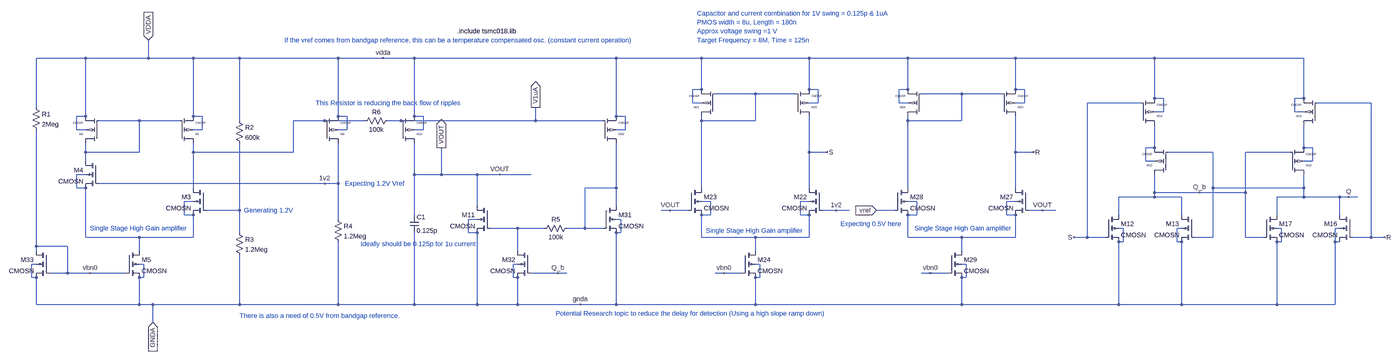
[diagram p0: schematic Oscillator.asc, whole sheet]
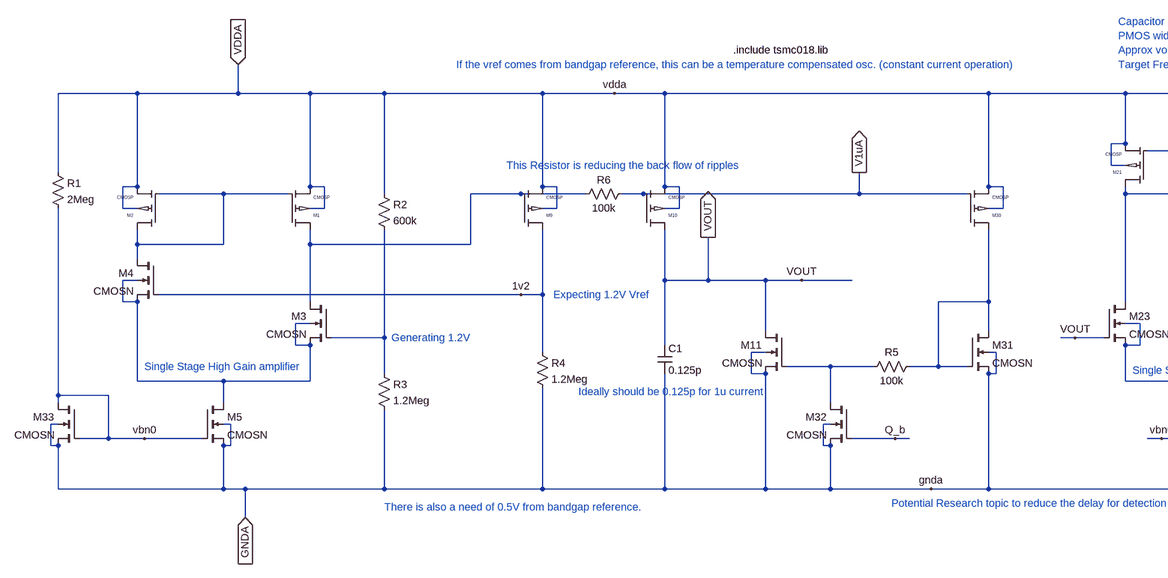
[diagram p1: schematic Oscillator.asc, part, row 1 of 1, column 1 of 2]
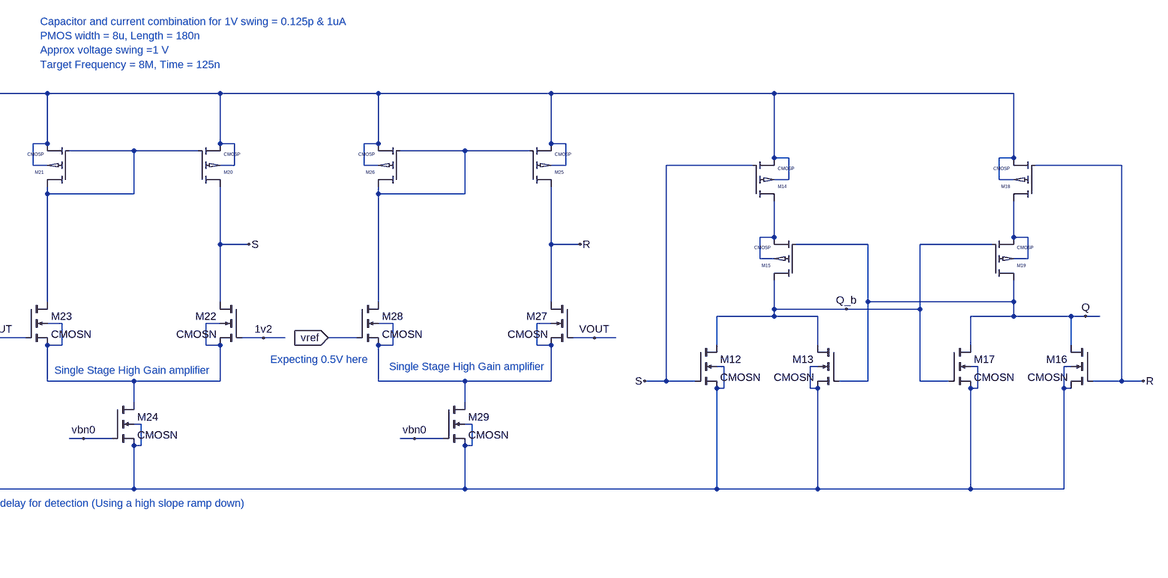
[diagram p2: schematic Oscillator.asc, part, row 1 of 1, column 2 of 2]
Oscillator.asc, the LTspice schematic file:
Version 4
SHEET 1 6116 744
WIRE 352 -336 176 -336
WIRE 576 -336 576 -400
WIRE 576 -336 352 -336
WIRE 736 -336 576 -336
WIRE 976 -336 736 -336
WIRE 1328 -336 976 -336
WIRE 1488 -336 1328 -336
WIRE 1600 -336 1488 -336
WIRE 2320 -336 1600 -336
WIRE 2624 -336 2320 -336
WIRE 3008 -336 2624 -336
WIRE 3360 -336 3008 -336
WIRE 3744 -336 3360 -336
WIRE 4240 -336 3744 -336
WIRE 4832 -336 4240 -336
WIRE 2624 -224 2624 -336
WIRE 2624 -224 2592 -224
WIRE 3008 -224 3008 -336
WIRE 3040 -224 3008 -224
WIRE 3360 -224 3360 -336
WIRE 3360 -224 3328 -224
WIRE 3744 -224 3744 -336
WIRE 3776 -224 3744 -224
WIRE 2816 -208 2672 -208
WIRE 2960 -208 2816 -208
WIRE 3552 -208 3408 -208
WIRE 3696 -208 3552 -208
WIRE 4240 -192 4240 -336
WIRE 4272 -192 4240 -192
WIRE 4832 -192 4832 -336
WIRE 4832 -192 4800 -192
WIRE 2592 -176 2592 -224
WIRE 2624 -176 2592 -176
WIRE 3040 -176 3040 -224
WIRE 3040 -176 3008 -176
WIRE 3328 -176 3328 -224
WIRE 3360 -176 3328 -176
WIRE 3776 -176 3776 -224
WIRE 3776 -176 3744 -176
WIRE 4192 -176 4000 -176
WIRE 5072 -176 4880 -176
WIRE 176 -160 176 -336
WIRE 4272 -144 4272 -192
WIRE 4272 -144 4240 -144
WIRE 4800 -144 4800 -192
WIRE 4832 -144 4800 -144
WIRE 352 -128 352 -336
WIRE 352 -128 320 -128
WIRE 736 -128 736 -336
WIRE 768 -128 736 -128
WIRE 1328 -128 1328 -336
WIRE 1360 -128 1328 -128
WIRE 1600 -128 1600 -336
WIRE 1632 -128 1600 -128
WIRE 2320 -128 2320 -336
WIRE 2352 -128 2320 -128
WIRE 544 -112 400 -112
WIRE 688 -112 544 -112
WIRE 976 -112 976 -336
WIRE 1280 -112 1168 -112
WIRE 1424 -112 1280 -112
WIRE 1552 -112 1504 -112
WIRE 2032 -112 2032 -160
WIRE 2032 -112 1552 -112
WIRE 2272 -112 2032 -112
WIRE 2624 -112 2624 -128
WIRE 2816 -112 2816 -208
WIRE 2816 -112 2624 -112
WIRE 3360 -112 3360 -128
WIRE 3552 -112 3552 -208
WIRE 3552 -112 3360 -112
WIRE 320 -80 320 -128
WIRE 352 -80 320 -80
WIRE 768 -80 768 -128
WIRE 768 -80 736 -80
WIRE 1360 -80 1360 -128
WIRE 1360 -80 1328 -80
WIRE 1632 -80 1632 -128
WIRE 1632 -80 1600 -80
WIRE 2352 -80 2352 -128
WIRE 2352 -80 2320 -80
WIRE 4240 -16 4240 -96
WIRE 4240 -16 4208 -16
WIRE 4832 -16 4832 -96
WIRE 4864 -16 4832 -16
WIRE 352 0 352 -32
WIRE 544 0 544 -112
WIRE 544 0 352 0
WIRE 736 0 736 -32
WIRE 1168 0 1168 -112
WIRE 1168 0 736 0
WIRE 3008 0 3008 -128
WIRE 3072 0 3008 0
WIRE 3744 0 3744 -128
WIRE 3808 0 3744 0
WIRE 4448 0 4288 0
WIRE 4784 0 4624 0
WIRE 352 32 352 0
WIRE 4208 32 4208 -16
WIRE 4240 32 4208 32
WIRE 4864 32 4864 -16
WIRE 4864 32 4832 32
WIRE 352 80 320 80
WIRE 1600 80 1600 -32
WIRE 1696 80 1696 -16
WIRE 1696 80 1600 80
WIRE 1824 80 1696 80
WIRE 1904 80 1824 80
WIRE 2016 80 1904 80
WIRE 1280 112 400 112
WIRE 1328 112 1328 -32
WIRE 1328 112 1280 112
WIRE 320 128 320 80
WIRE 352 128 320 128
WIRE 736 128 736 0
WIRE 2320 128 2320 -32
WIRE 2320 128 2208 128
WIRE 2624 128 2624 -112
WIRE 3008 128 3008 0
WIRE 3360 128 3360 -112
WIRE 3744 128 3744 0
WIRE 4448 128 4448 0
WIRE 4832 128 4832 80
WIRE 4832 128 4448 128
WIRE 4240 144 4240 80
WIRE 4400 144 4240 144
WIRE 4624 144 4624 0
WIRE 4624 144 4400 144
WIRE 4240 160 4240 144
WIRE 4240 160 4112 160
WIRE 4336 160 4240 160
WIRE 4832 160 4832 128
WIRE 4832 160 4736 160
WIRE 4960 160 4832 160
WIRE 4992 160 4960 160
WIRE 5024 160 4992 160
WIRE 736 176 704 176
WIRE 2656 176 2624 176
WIRE 3008 176 2976 176
WIRE 3392 176 3360 176
WIRE 3744 176 3712 176
WIRE 1824 192 1824 80
WIRE 2320 192 2320 128
WIRE 976 208 976 -32
WIRE 976 208 784 208
WIRE 2512 208 2480 208
WIRE 2576 208 2512 208
WIRE 3104 208 3056 208
WIRE 3152 208 3104 208
WIRE 3312 208 3248 208
WIRE 3840 208 3792 208
WIRE 3888 208 3840 208
WIRE 704 224 704 176
WIRE 736 224 704 224
WIRE 1600 224 1600 80
WIRE 2656 224 2656 176
WIRE 2656 224 2624 224
WIRE 2976 224 2976 176
WIRE 3008 224 2976 224
WIRE 3392 224 3392 176
WIRE 3392 224 3360 224
WIRE 3712 224 3712 176
WIRE 3744 224 3712 224
WIRE 4112 224 4112 160
WIRE 4336 224 4336 160
WIRE 4736 224 4736 160
WIRE 4960 224 4960 160
WIRE 1328 240 1328 112
WIRE 1824 240 1792 240
WIRE 2336 240 2320 240
WIRE 1968 272 1872 272
WIRE 2064 272 1968 272
WIRE 2208 272 2208 128
WIRE 2208 272 2144 272
WIRE 2272 272 2208 272
WIRE 4128 272 4112 272
WIRE 4336 272 4320 272
WIRE 4752 272 4736 272
WIRE 4960 272 4944 272
WIRE 976 288 976 208
WIRE 1792 288 1792 240
WIRE 1824 288 1792 288
WIRE 2336 288 2336 240
WIRE 2336 288 2320 288
WIRE 352 304 352 128
WIRE 544 304 352 304
WIRE 736 304 736 224
WIRE 736 304 544 304
WIRE 2624 304 2624 224
WIRE 2816 304 2624 304
WIRE 3008 304 3008 224
WIRE 3008 304 2816 304
WIRE 3360 304 3360 224
WIRE 3552 304 3360 304
WIRE 3744 304 3744 224
WIRE 3744 304 3552 304
WIRE 4000 304 4000 -176
WIRE 4000 304 3952 304
WIRE 4064 304 4000 304
WIRE 4448 304 4448 128
WIRE 4448 304 4384 304
WIRE 4624 304 4624 144
WIRE 4688 304 4624 304
WIRE 5072 304 5072 -176
WIRE 5072 304 5008 304
WIRE 5120 304 5072 304
WIRE 4128 320 4128 272
WIRE 4128 320 4112 320
WIRE 4320 320 4320 272
WIRE 4336 320 4320 320
WIRE 4752 320 4752 272
WIRE 4752 320 4736 320
WIRE 4944 320 4944 272
WIRE 4960 320 4944 320
WIRE 176 336 176 -80
WIRE 288 336 176 336
WIRE 176 352 176 336
WIRE 544 352 544 304
WIRE 1968 352 1968 272
WIRE 2816 352 2816 304
WIRE 3552 352 3552 304
WIRE 176 400 160 400
WIRE 560 400 544 400
WIRE 1968 400 1952 400
WIRE 2832 400 2816 400
WIRE 3568 400 3552 400
WIRE 288 432 288 336
WIRE 288 432 224 432
WIRE 368 432 288 432
WIRE 496 432 368 432
WIRE 2112 432 2016 432
WIRE 2144 432 2112 432
WIRE 2704 432 2672 432
WIRE 2768 432 2704 432
WIRE 3440 432 3408 432
WIRE 3504 432 3440 432
WIRE 160 448 160 400
WIRE 176 448 160 448
WIRE 560 448 560 400
WIRE 560 448 544 448
WIRE 1952 448 1952 400
WIRE 1968 448 1952 448
WIRE 2832 448 2832 400
WIRE 2832 448 2816 448
WIRE 3568 448 3568 400
WIRE 3568 448 3552 448
WIRE 176 544 176 448
WIRE 544 544 544 448
WIRE 544 544 176 544
WIRE 592 544 544 544
WIRE 976 544 976 368
WIRE 976 544 592 544
WIRE 1328 544 1328 320
WIRE 1328 544 976 544
WIRE 1600 544 1600 288
WIRE 1600 544 1328 544
WIRE 1824 544 1824 288
WIRE 1824 544 1600 544
WIRE 1968 544 1968 448
WIRE 1968 544 1824 544
WIRE 2192 544 1968 544
WIRE 2320 544 2320 288
WIRE 2320 544 2192 544
WIRE 2816 544 2816 448
WIRE 2816 544 2320 544
WIRE 3552 544 3552 448
WIRE 3552 544 2816 544
WIRE 4112 544 4112 320
WIRE 4112 544 3552 544
WIRE 4336 544 4336 320
WIRE 4336 544 4112 544
WIRE 4736 544 4736 320
WIRE 4736 544 4336 544
WIRE 4944 544 4944 320
WIRE 4944 544 4736 544
WIRE 592 608 592 544
FLAG 3248 208 vref
IOPIN 3248 208 In
FLAG 576 -400 VDDA
IOPIN 576 -400 In
FLAG 592 608 GNDA
IOPIN 592 608 In
FLAG 368 432 vbn0
FLAG 1696 -16 VOUT
IOPIN 1696 -16 Out
FLAG 1488 -336 vdda
FLAG 4992 160 Q
FLAG 3952 304 S
FLAG 5120 304 R
FLAG 4400 144 Q_b
FLAG 1904 80 VOUT
FLAG 2192 544 gnda
FLAG 3104 208 1v2
FLAG 2512 208 VOUT
FLAG 3072 0 S
FLAG 2704 432 vbn0
FLAG 3840 208 VOUT
FLAG 3808 0 R
FLAG 3440 432 vbn0
FLAG 2112 432 Q_b
FLAG 1280 112 1v2
FLAG 2032 -160 V1uA
IOPIN 2032 -160 Out
SYMBOL cmosp 688 -32 M180
SYMATTR InstName M1
SYMATTR Value2 l=360n w=2.5u
SYMBOL cmosp 400 -32 R180
SYMATTR InstName M2
SYMATTR Value2 l=360n w=2.5u
SYMBOL cmosn 784 128 M0
SYMATTR InstName M3
SYMATTR Value2 l=360n w=500n
SYMBOL cmosn 400 32 M0
SYMATTR InstName M4
SYMATTR Value2 l=360n w=500n
SYMBOL cmosn 496 352 R0
SYMATTR InstName M5
SYMATTR Value2 l=720n w=2u
SYMBOL cmosp 1280 -32 M180
SYMATTR InstName M9
SYMATTR Value2 l=180n w=1u
SYMBOL cmosp 1552 -32 M180
SYMATTR InstName M10
SYMATTR Value2 l=180n w=1.1u
SYMBOL cap 1584 224 R0
SYMATTR InstName C1
SYMATTR Value 0.125p
SYMBOL cmosn 1872 192 M0
SYMATTR InstName M11
SYMATTR Value2 l=180n w=2.2u
SYMBOL cmosn 4064 224 R0
SYMATTR InstName M12
SYMATTR Value2 l=180n w=270n
SYMBOL cmosn 4384 224 M0
SYMATTR InstName M13
SYMATTR Value2 l=180n w=270n
SYMBOL cmosp 4192 -96 M180
SYMATTR InstName M14
SYMATTR Value2 l=180n w=1u
SYMBOL cmosp 4288 80 R180
SYMATTR InstName M15
SYMATTR Value2 l=180n w=1u
SYMBOL cmosn 5008 224 M0
SYMATTR InstName M16
SYMATTR Value2 l=180n w=270n
SYMBOL cmosn 4688 224 R0
SYMATTR InstName M17
SYMATTR Value2 l=180n w=270n
SYMBOL cmosp 4880 -96 R180
SYMATTR InstName M18
SYMATTR Value2 l=180n w=270n
SYMBOL cmosp 4784 80 M180
SYMATTR InstName M19
SYMATTR Value2 l=180n w=270n
SYMBOL cmosp 2960 -128 M180
SYMATTR InstName M20
SYMATTR Value2 l=180n w=5u
SYMBOL cmosp 2672 -128 R180
SYMATTR InstName M21
SYMATTR Value2 l=180n w=5u
SYMBOL cmosn 3056 128 M0
SYMATTR InstName M22
SYMATTR Value2 l=180n w=1u
SYMBOL cmosn 2576 128 R0
SYMATTR InstName M23
SYMATTR Value2 l=180n w=1u
SYMBOL cmosn 2768 352 R0
SYMATTR InstName M24
SYMATTR Value2 l=720n w=2u
SYMBOL cmosp 3696 -128 M180
SYMATTR InstName M25
SYMATTR Value2 l=180n w=1u
SYMBOL cmosp 3408 -128 R180
SYMATTR InstName M26
SYMATTR Value2 l=180n w=1u
SYMBOL cmosn 3792 128 M0
SYMATTR InstName M27
SYMATTR Value2 l=180n w=270n
SYMBOL cmosn 3312 128 R0
SYMATTR InstName M28
SYMATTR Value2 l=180n w=270n
SYMBOL cmosn 3504 352 R0
SYMATTR InstName M29
SYMATTR Value2 l=720n w=2u
SYMBOL cmosp 2272 -32 M180
SYMATTR InstName M30
SYMATTR Value2 l=180n w=11u
SYMBOL res 2160 256 R90
WINDOW 0 0 56 VBottom 2
WINDOW 3 32 56 VTop 2
SYMATTR InstName R5
SYMATTR Value 100k
SYMBOL cmosn 2272 192 R0
SYMATTR InstName M31
SYMATTR Value2 l=180n w=1u
SYMBOL cmosn 2016 352 M0
SYMATTR InstName M32
SYMATTR Value2 l=180n w=270n
SYMBOL res 1520 -128 R90
WINDOW 0 0 56 VBottom 2
WINDOW 3 32 56 VTop 2
SYMATTR InstName R6
SYMATTR Value 100k
SYMBOL cmosn 224 352 M0
SYMATTR InstName M33
SYMATTR Value2 l=720n w=2u
SYMBOL res 1312 224 R0
SYMATTR InstName R4
SYMATTR Value 1.2Meg
SYMBOL res 160 -176 R0
SYMATTR InstName R1
SYMATTR Value 2Meg
SYMBOL res 960 -128 R0
SYMATTR InstName R2
SYMATTR Value 600k
SYMBOL res 960 272 R0
SYMATTR InstName R3
SYMATTR Value 1.2Meg
TEXT 368 272 Left 2 ;Single Stage High Gain amplifier
TEXT 1752 -432 Left 2 !.include tsmc018.lib
TEXT 2608 -464 Left 2 ;PMOS width = 8u, Length = 180n
TEXT 2608 -432 Left 2 ;Approx voltage swing =1 V
TEXT 2608 -400 Left 2 ;Target Frequency = 8M, Time = 125n
TEXT 2608 -496 Left 2 ;Capacitor and current combination for 1V swing = 0.125p & 1uA
TEXT 976 584 Left 2 ;There is also a need of 0.5V from bandgap reference.
TEXT 1136 -400 Left 2 ;If the vref comes from bandgap reference, this can be a temperature compensated osc. (constant current operation)
TEXT 2640 280 Left 2 ;Single Stage High Gain amplifier
TEXT 3384 272 Left 2 ;Single Stage High Gain amplifier
TEXT 2104 576 Left 2 ;Potential Research topic to reduce the delay for detection (Using a high slope ramp down)
TEXT 1248 -176 Left 2 ;This Resistor is reducing the back flow of ripples
TEXT 1352 112 Left 2 ;Expecting 1.2V Vref
TEXT 1408 328 Left 2 ;Ideally should be 0.125p for 1u current
TEXT 3120 256 Left 2 ;Expecting 0.5V here
TEXT 992 208 Left 2 ;Generating 1.2V

The netlist it stands for:
* Oscillator.asc
M1 N004 N003 VDDA VDDA CMOSP l=360n w=2.5u
M2 N003 N003 VDDA VDDA CMOSP l=360n w=2.5u
M3 N004 N011 N007 N007 CMOSN l=360n w=500n
M4 N003 1v2 N007 N007 CMOSN l=360n w=500n
M5 N007 vbn0 GNDA GNDA CMOSN l=720n w=2u
M9 1v2 N004 VDDA VDDA CMOSP l=180n w=1u
M10 VOUT V1uA VDDA VDDA CMOSP l=180n w=1.1u
C1 VOUT GNDA 0.125p
M11 VOUT N012 GNDA GNDA CMOSN l=180n w=2.2u
M12 Q_b S GNDA GNDA CMOSN l=180n w=270n
M13 Q_b Q GNDA GNDA CMOSN l=180n w=270n
M14 N005 S VDDA VDDA CMOSP l=180n w=1u
M15 Q_b Q N005 N005 CMOSP l=180n w=1u
M16 Q R GNDA GNDA CMOSN l=180n w=270n
M17 Q Q_b GNDA GNDA CMOSN l=180n w=270n
M18 N006 R VDDA VDDA CMOSP l=180n w=270n
M19 Q Q_b N006 N006 CMOSP l=180n w=270n
M20 S N001 VDDA VDDA CMOSP l=180n w=5u
M21 N001 N001 VDDA VDDA CMOSP l=180n w=5u
M22 S 1v2 N009 N009 CMOSN l=180n w=1u
M23 N001 VOUT N009 N009 CMOSN l=180n w=1u
M24 N009 vbn0 GNDA GNDA CMOSN l=720n w=2u
M25 R N002 VDDA VDDA CMOSP l=180n w=1u
M26 N002 N002 VDDA VDDA CMOSP l=180n w=1u
M27 R VOUT N010 N010 CMOSN l=180n w=270n
M28 N002 vref N010 N010 CMOSN l=180n w=270n
M29 N010 vbn0 GNDA GNDA CMOSN l=720n w=2u
M30 N008 V1uA VDDA VDDA CMOSP l=180n w=11u
R5 N008 N012 100k
M31 N008 N008 GNDA GNDA CMOSN l=180n w=1u
M32 N012 Q_b GNDA GNDA CMOSN l=180n w=270n
R6 V1uA N004 100k
M33 vbn0 vbn0 GNDA GNDA CMOSN l=720n w=2u
R4 1v2 GNDA 1.2Meg
R1 VDDA vbn0 2Meg
R2 VDDA N011 600k
R3 N011 GNDA 1.2Meg
.model NMOS NMOS
.model PMOS PMOS
.lib standard.mos
* Single Stage High Gain amplifier
.include tsmc018.lib
* PMOS width = 8u, Length = 180n
* Approx voltage swing =1 V
* Target Frequency = 8M, Time = 125n
* Capacitor and current combination for 1V swing = 0.125p & 1uA
* There is also a need of 0.5V from bandgap reference.
* If the vref comes from bandgap reference, this can be a temperature compensated osc. (constant current operation)
* Single Stage High Gain amplifier
* Single Stage High Gain amplifier
* Potential Research topic to reduce the delay for detection (Using a high slope ramp down)
* This Resistor is reducing the back flow of ripples
* Expecting 1.2V Vref
* Ideally should be 0.125p for 1u current
* Expecting 0.5V here
* Generating 1.2V
.lib tsmc018.lib
.backanno
.end